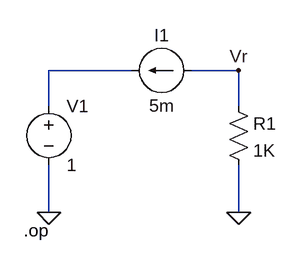
[diagram p0: schematic 03_operationPoint.asc]
03_operationPoint.asc, the LTspice schematic file:
Version 4
SHEET 1 880 680
WIRE 240 64 128 64
WIRE 384 64 320 64
WIRE 128 112 128 64
WIRE 384 112 384 64
WIRE 128 256 128 192
WIRE 384 256 384 192
FLAG 128 256 0
FLAG 384 256 0
FLAG 384 64 Vr
SYMBOL voltage 128 96 R0
SYMATTR InstName V1
SYMATTR Value 1
SYMBOL current 320 64 R90
WINDOW 0 -32 40 VBottom 2
WINDOW 3 32 40 VTop 2
SYMATTR InstName I1
SYMATTR Value 5m
SYMBOL res 368 96 R0
SYMATTR InstName R1
SYMATTR Value 1K
TEXT 94 280 Left 2 !.op

The netlist it stands for:
* 03_operationPoint.asc
V1 N001 0 1
I1 Vr N001 5m
R1 Vr 0 1K
.op
.backanno
.end